# EAGLE schematic Works_007_b (EAGLE 8.2.1)
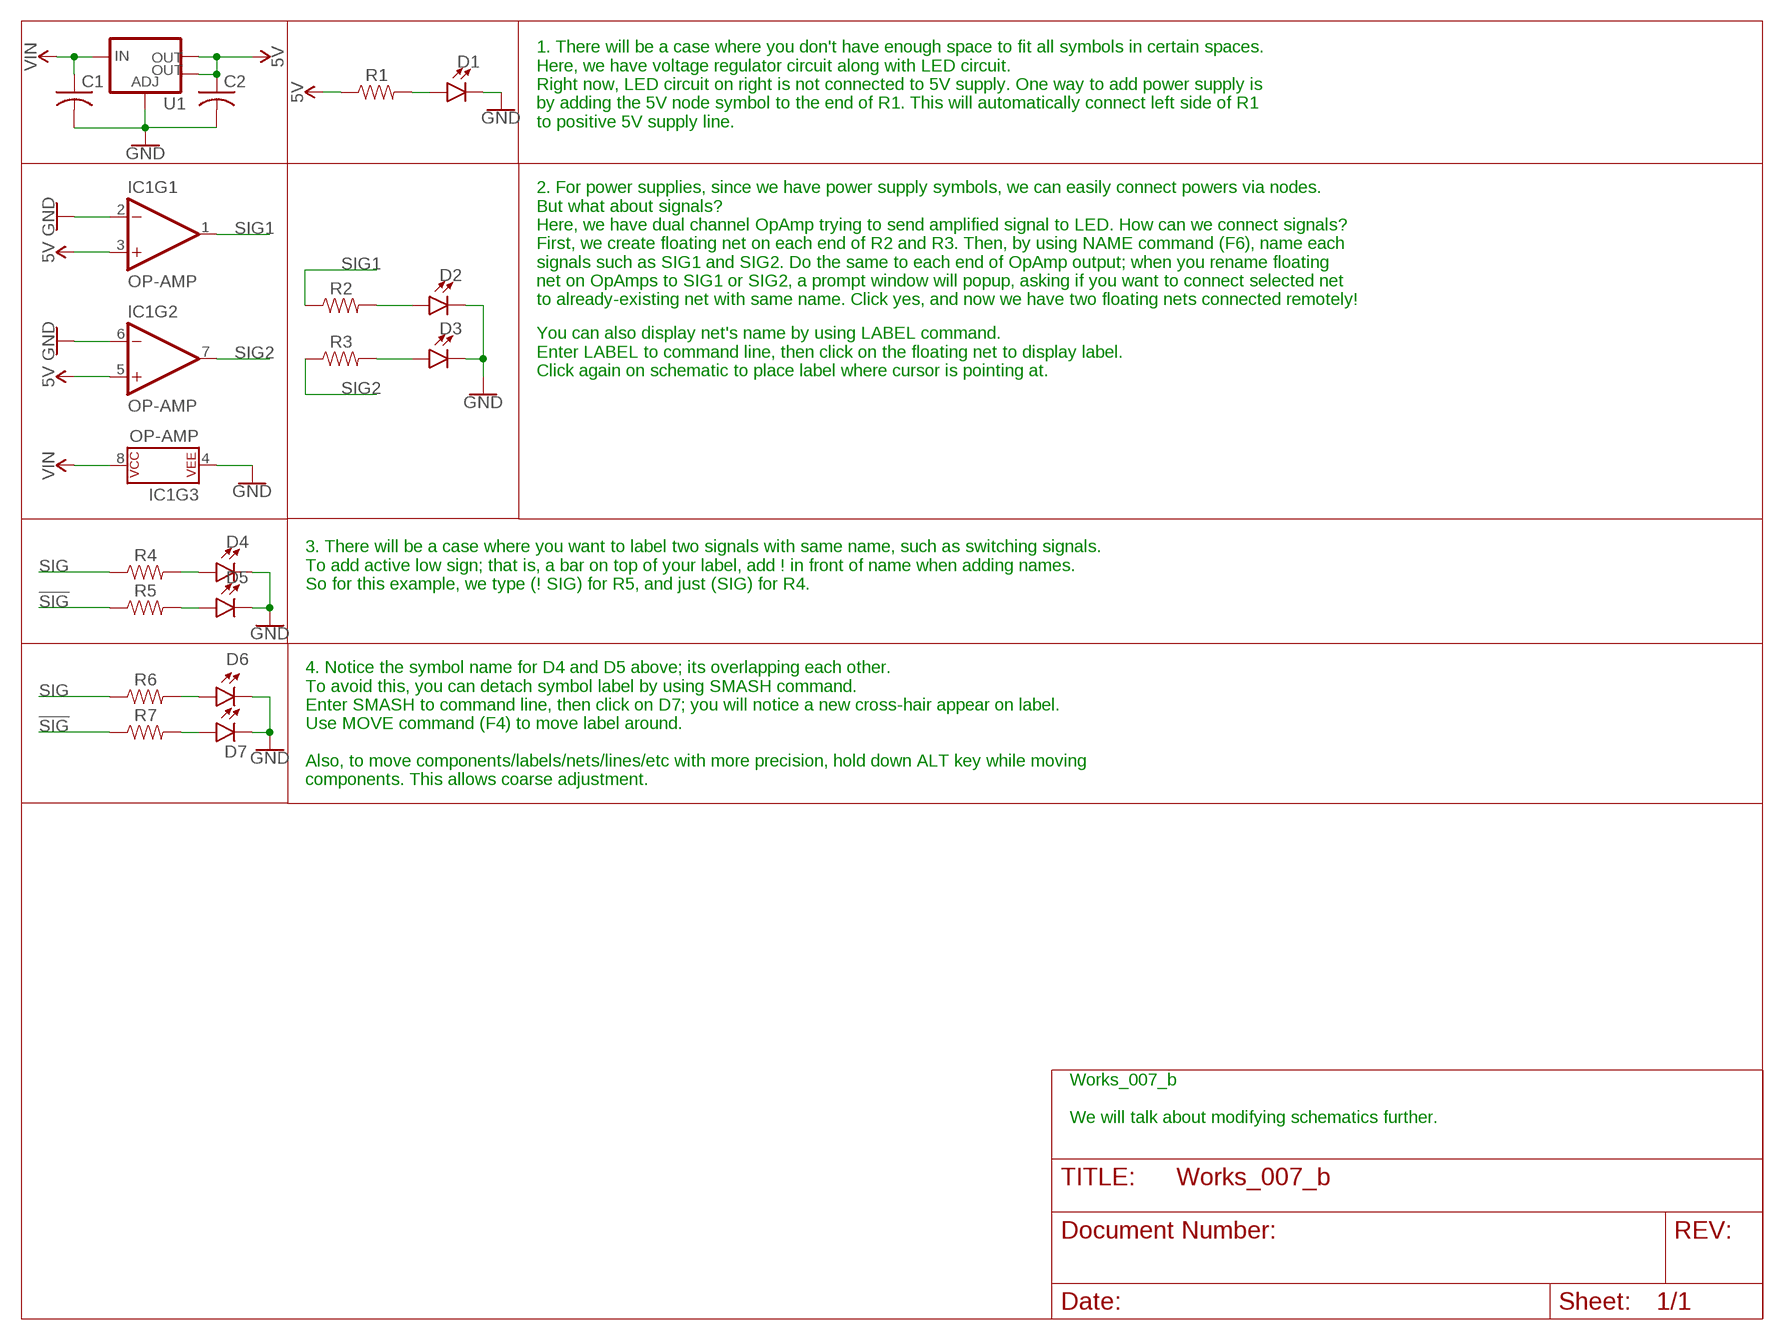
[diagram p0: schematic, sheet 1]

## Parts
C1  C-USC0805  [C0805]
C2  C-USC0805  [C0805]
D1  LED5MM  [LED_5MM]
D2  LED5MM  [LED_5MM]
D3  LED5MM  [LED_5MM]
D4  LED5MM  [LED_5MM]
D5  LED5MM  [LED_5MM]
D6  LED5MM  [LED_5MM]
D7  LED5MM  [LED_5MM]
IC1  OP-AMP  OPAMP-DUALDIP  [DIP08]
R1  RESISTOR0805  [0805]
R2  RESISTOR0805  [0805]
R3  RESISTOR0805  [0805]
R4  RESISTOR0805  [0805]
R5  RESISTOR0805  [0805]
R6  RESISTOR0805  [0805]
R7  RESISTOR0805  [0805]
U1  V_REG_LM1117SOT223  [SOT223]

## Nets
5V: C2.1 IC1.3(+IN) IC1.5(+IN) R1.1 U1.2(OUT) U1.4(OUT)
!SIG: R5.1 R7.1
GND: C1.2 C2.2 D1.K(C) D2.K(C) D3.K(C) D4.K(C) D5.K(C) D6.K(C) D7.K(C) IC1.2(-IN) IC1.4(P$V-) IC1.6(-IN) U1.1(ADJ)
N$1: D7.A R7.2
N$2: D5.A R5.2
N$3: D1.A R1.2
N$4: D4.A R4.2
N$5: D6.A R6.2
N$6: D2.A R2.2
N$7: D3.A R3.2
SIG: R4.1 R6.1
SIG1: IC1.1(OUT) R2.1
SIG2: IC1.7(OUT) R3.1
VIN: C1.1 IC1.8(P$V+) U1.3(IN)

## Notes on the sheet
- 1. There will be a case where you don't have enough space to fit all symbols in certain spaces.
  Here, we have voltage regulator circuit along with LED circuit.
  Right now, LED circuit on right is not connected to 5V supply. One way to add power supply is
  by adding the 5V node symbol to the end of R1. This will automatically connect left side of R1
  to positive 5V supply line.
- 2. For power supplies, since we have power supply symbols, we can easily connect powers via nodes.
  But what about signals?
  Here, we have dual channel OpAmp trying to send amplified signal to LED. How can we connect signals?
  First, we create floating net on each end of R2 and R3. Then, by using NAME command (F6), name each
  signals such as SIG1 and SIG2. Do the same to each end of OpAmp output; when you rename floating
  net on OpAmps to SIG1 or SIG2, a prompt window will popup, asking if you want to connect selected net
  to already-existing net with same name. Click yes, and now we have two floating nets connected remotely!
- You can also display net's name by using LABEL command.
  Enter LABEL to command line, then click on the floating net to display label.
  Click again on schematic to place label where cursor is pointing at.
- 3. There will be a case where you want to label two signals with same name, such as switching signals.
  To add active low sign; that is, a bar on top of your label, add ! in front of name when adding names.
  So for this example, we type (! SIG) for R5, and just (SIG) for R4.
- 4. Notice the symbol name for D4 and D5 above; its overlapping each other.
  To avoid this, you can detach symbol label by using SMASH command.
  Enter SMASH to command line, then click on D7; you will notice a new cross-hair appear on label.
  Use MOVE command (F4) to move label around.
  
  Also, to move components/labels/nets/lines/etc with more precision, hold down ALT key while moving
  components. This allows coarse adjustment.
- Works_007_b
  
  We will talk about modifying schematics further.

## Library data of the parts
C1 C2 = resistor:C-US: CAPACITOR, American symbol
D1-D7 = SparkFun-LED:LED: LED (Generic) Standard schematic elements and footprints for 5mm, 3mm, 1206, and 0603 sized LEDs. Generic LEDs with no color specified.
IC1 = SparkFun-IC-Amplifiers:OPAMP-DUAL: Generic op-amp footprint This component is for the standard 358 pinning of a dual op-amp From the LM358 datasheet: Pin 1: Output A Pin 2: Inverting Input A Pin 3: Non-Inverting Input A Pin 4: Gnd Pin 5: Non-Inverting Input B Pin 6: Inverting Input B Pin 7: Output B Pin 8: V+; PROD_ID: NA-XXXXX
R1-R7 = SparkFun-Resistors:RESISTOR: Generic Resistor Package
U1 = SparkFun-IC-Power:V_REG_LM1117: Voltage Regulator LM1117 Standard adjustable voltage regulator but in SMD form. Spark Fun Electronics SKU : COM-00595; PROD_ID: VREG-08170